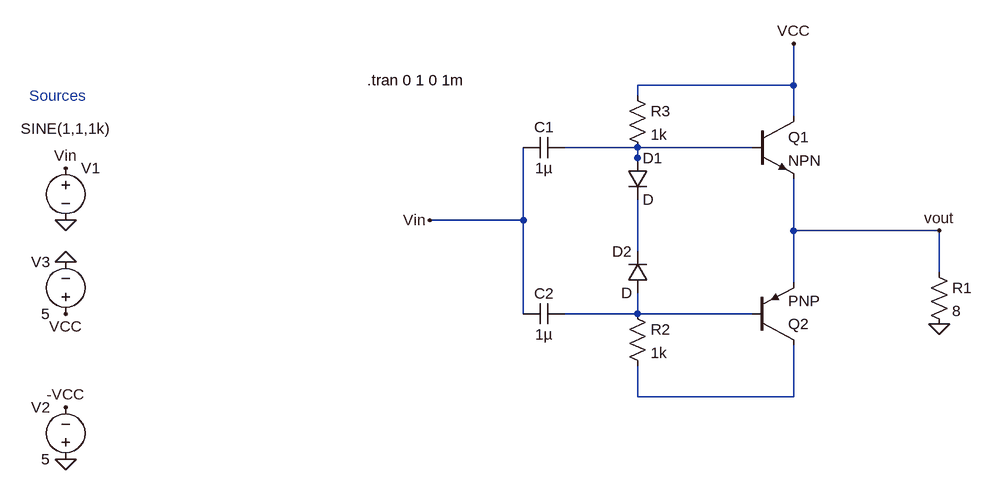
[diagram p0: schematic Amplificador_AB.asc]
Amplificador_AB.asc, the LTspice schematic file:
Version 4
SHEET 1 880 680
WIRE 144 -64 144 -128
WIRE 144 -64 -96 -64
WIRE -96 -48 -96 -64
WIRE 144 -16 144 -64
WIRE -96 32 -208 32
WIRE 80 32 -96 32
WIRE -96 48 -96 32
WIRE -96 64 -96 48
WIRE -272 144 -272 32
WIRE -272 144 -416 144
WIRE 144 160 144 80
WIRE 368 160 144 160
WIRE -96 192 -96 112
WIRE 368 224 368 160
WIRE 144 240 144 160
WIRE -272 288 -272 144
WIRE -96 288 -96 256
WIRE -96 288 -208 288
WIRE 80 288 -96 288
WIRE -96 416 -96 368
WIRE 144 416 144 336
WIRE 144 416 -96 416
FLAG -976 144 0
FLAG -976 512 0
FLAG -976 208 0
FLAG -976 64 Vin
FLAG -416 144 Vin
FLAG -976 288 VCC
FLAG 144 -128 VCC
FLAG -976 432 -VCC
FLAG 368 304 0
FLAG 368 160 vout
SYMBOL npn 80 -16 R0
SYMATTR InstName Q1
SYMBOL pnp 80 336 M180
SYMATTR InstName Q2
SYMBOL voltage -976 48 R0
WINDOW 3 -69 -45 Left 2
SYMATTR InstName V1
SYMATTR Value SINE(1,1,1k)
SYMBOL voltage -976 528 R180
WINDOW 0 24 96 Left 2
WINDOW 3 24 16 Left 2
WINDOW 123 0 0 Left 0
WINDOW 39 0 0 Left 0
SYMATTR InstName V2
SYMATTR Value 5
SYMBOL voltage -976 304 R180
WINDOW 0 24 96 Left 2
WINDOW 3 24 16 Left 2
WINDOW 123 0 0 Left 0
WINDOW 39 0 0 Left 0
SYMATTR InstName V3
SYMATTR Value 5
SYMBOL res 352 208 R0
SYMATTR InstName R1
SYMATTR Value 8
SYMBOL cap -208 16 R90
WINDOW 0 0 32 VBottom 2
WINDOW 3 32 32 VTop 2
SYMATTR InstName C1
SYMATTR Value 1µ
SYMBOL cap -208 272 R90
WINDOW 0 0 32 VBottom 2
WINDOW 3 32 32 VTop 2
SYMATTR InstName C2
SYMATTR Value 1µ
SYMBOL diode -112 48 R0
SYMATTR InstName D1
SYMBOL diode -80 256 R180
WINDOW 0 24 64 Left 2
WINDOW 3 24 0 Left 2
SYMATTR InstName D2
SYMBOL res -112 272 R0
SYMATTR InstName R2
SYMATTR Value 1k
SYMBOL res -112 -64 R0
SYMATTR InstName R3
SYMATTR Value 1k
TEXT -512 -72 Left 2 !.tran 0 1 0 1m
TEXT -1032 -48 Left 2 ;Sources

The netlist it stands for:
* Amplificador_AB.asc
Q1 VCC N001 vout 0 NPN
Q2 N004 N003 vout 0 PNP
V1 Vin 0 SINE(1,1,1k)
V2 0 -VCC 5
V3 VCC 0 5
R1 vout 0 8
C1 N001 Vin 1µ
C2 N003 Vin 1µ
D1 N001 N002 D
D2 N003 N002 D
R2 N003 N004 1k
R3 VCC N001 1k
.model D D
.lib standard.dio
.model NPN NPN
.model PNP PNP
.lib standard.bjt
.tran 0 1 0 1m
* Sources
.backanno
.end